# EAGLE design nano (EAGLE 7.2.0)
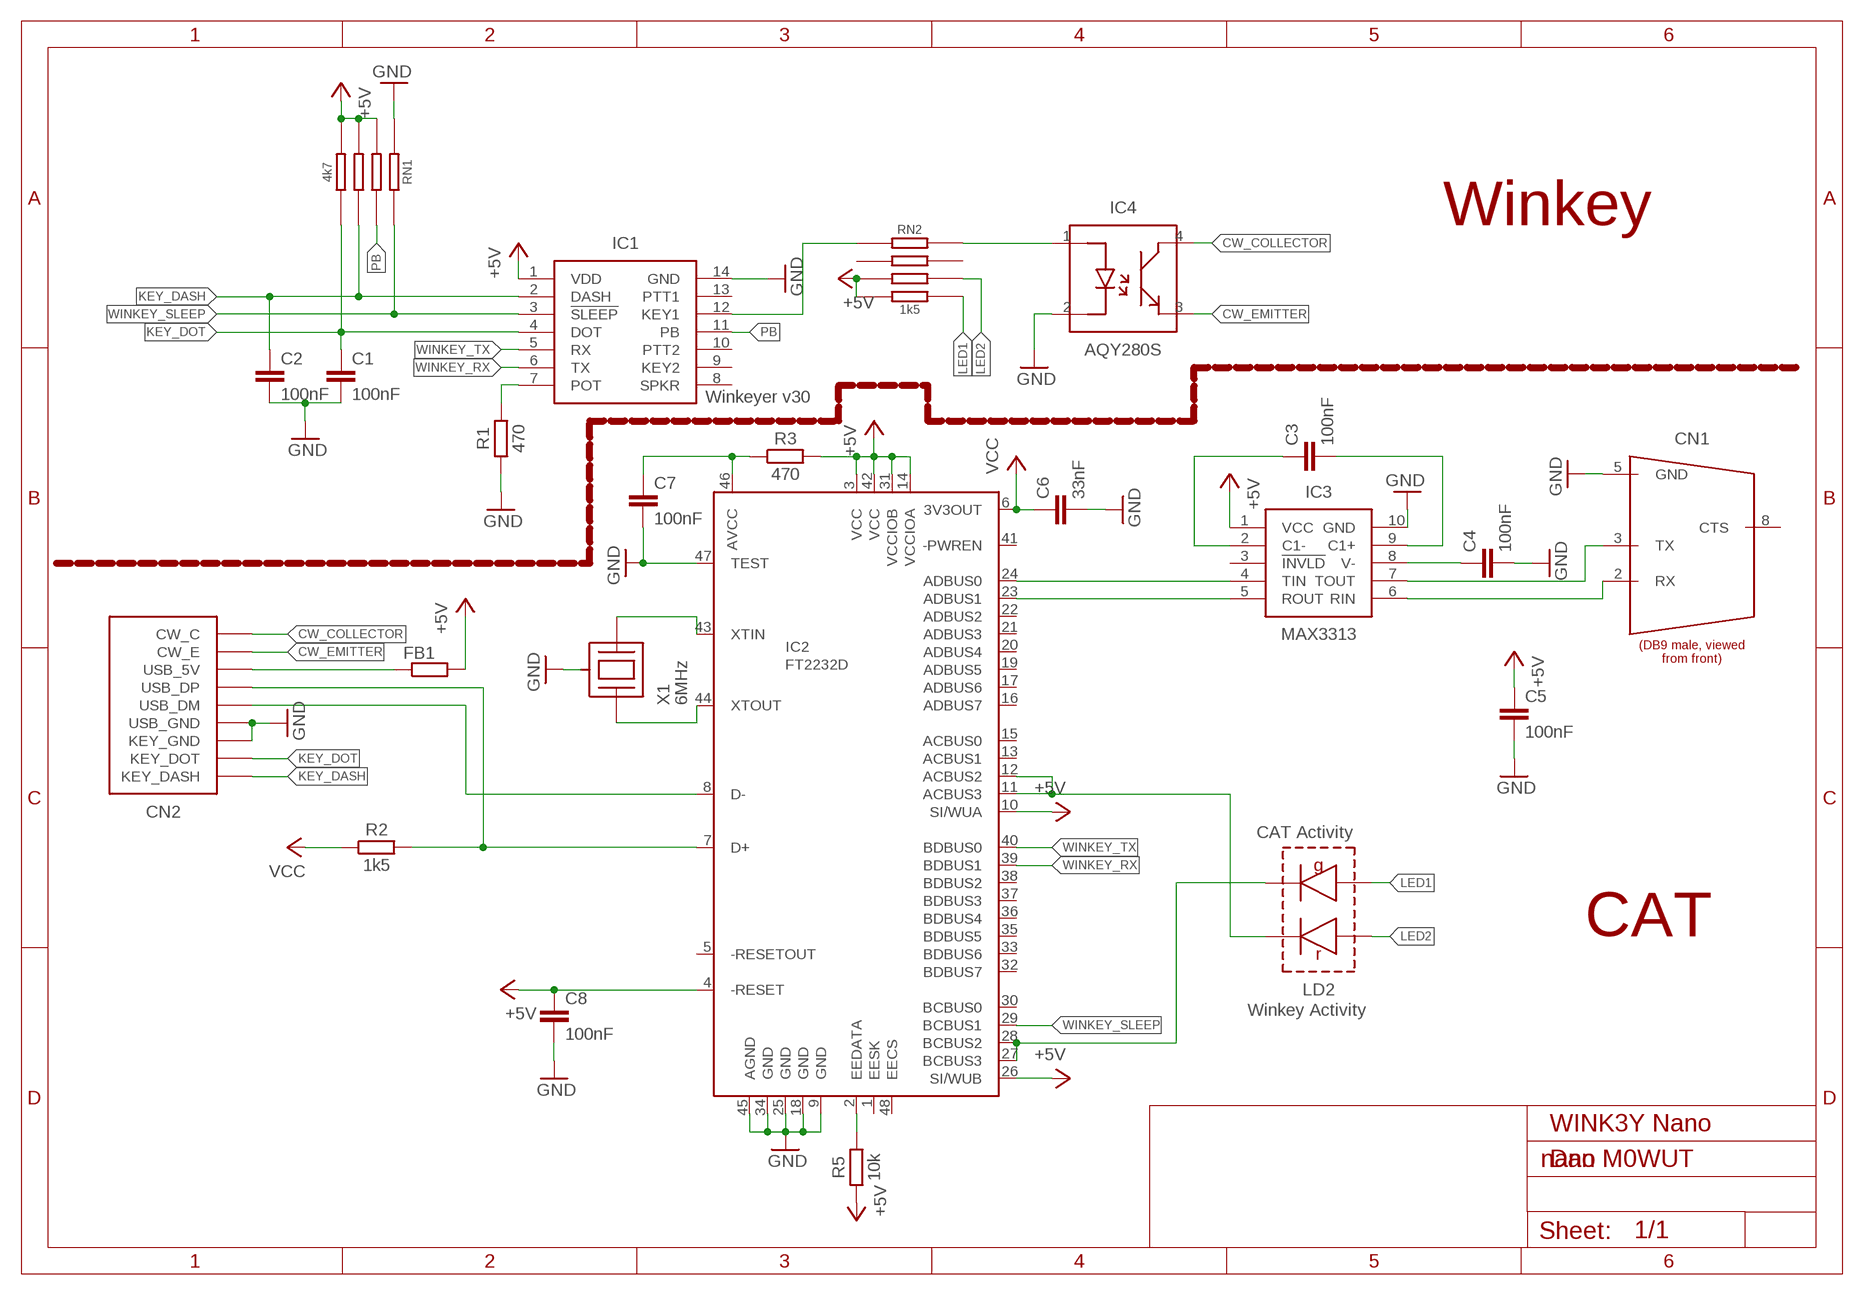
[diagram p0: schematic, sheet 1]

## Parts
C1  100nF  C-EUC0402  [C0402]
C2  100nF  C-EUC0402  [C0402]
C3  100nF  C-EUC0402  [C0402]
C4  100nF  C-EUC0402  [C0402]
C5  100nF  C-EUC0402  [C0402]
C6  33nF  C-EUC0402  [C0402]
C7  100nF  C-EUC0402  [C0402]
C8  100nF  C-EUC0402  [C0402]
CN1  CONN_DB9_MALE  [CONN_DB9]
CN2  CONN_WINK3Y  [CONN_2MMX9]
FB1  R-EU_R0805  [R0805]
IC1  WINKEYER  [SO14]
IC2  FT2232D  [QFP48-7X7]
IC3  IC_MAX3313  [IC_UMAX10]
IC4  IC_AQY280S  [IC_AQY280S]
LD2  LED_KINGBRIGHT_KPTB  [LED_KINGBRIGHT_KPTB]
R1  470  R-EU_R0402  [R0402]
R2  1k5  R-EU_R0402  [R0402]
R3  470  R-EU_R0402  [R0402]
R5  10k  R-EU_R0402  [R0402]
RN1  4k7  R_BOURNS_CAY16-J4  [R_BOURNS_CAY16-J4]
RN2  1k5  R_BOURNS_CAY16-J4  [R_BOURNS_CAY16-J4]
X1  6MHz  XTAL_MURATA_3-PIN-RES  [XTAL_MURATA_3-PIN-RES]

## Nets
+5V: C5.1 C8.1 FB1.2 IC1.1(VDD) IC2.3(VCC) IC2.4(-RESET) IC2.10(SI/WUA) IC2.14(VCCIOA) IC2.26(SI/WUB) IC2.31(VCCIOB) IC2.42(VCC) IC3.1(VCC) R3.2 R5.1 RN1.2 RN1.3 RN1.4 RN2.3 RN2.4
CAT_RX: IC2.23(ADBUS1) IC3.5(ROUT)
CAT_TX: IC2.24(ADBUS0) IC3.4(TIN)
CW_COLLECTOR: CN2.CW_COLLECTOR(CW_C) IC4.4(COLLECTOR)
CW_EMITTER: CN2.CW_EMITTER(CW_E) IC4.3(EMITTER)
GND: C1.2 C2.2 C4.2 C5.2 C6.2 C7.2 C8.2 CN1.5(GND) CN2.KEY_GND CN2.USB_GND IC1.14(GND) IC2.9(GND) IC2.18(GND) IC2.25(GND) IC2.34(GND) IC2.45(AGND) IC2.47(TEST) IC3.10(GND) IC4.2(CATHODE) R1.1 RN1.1 X1.GND(CAN)
KEY_DASH: C2.1 CN2.KEY_DASH IC1.2(DASH) RN1.3A
KEY_DOT: C1.1 CN2.KEY_DOT IC1.4(DOT) RN1.4A
LED1: LD2.3(G_ANODE) RN2.4A
LED2: LD2.1(R_ANODE) RN2.3A
N$1: C7.1 IC2.46(AVCC) R3.1
N$2: CN2.USB_5V FB1.1
N$3: IC2.43(XTIN) X1.2(XTAL2)
N$4: CN1.3(TX) IC3.7(TOUT)
N$5: CN1.2(RX) IC3.6(RIN)
N$6: C3.1 IC3.2(C1-)
N$7: C3.2 IC3.9(C1+)
N$8: C4.1 IC3.8(V-)
N$9: IC2.44(XTOUT) X1.1(XTAL1)
N$10: CN2.USB_DM IC2.8(D-)
N$11: IC1.12(KEY1) RN2.1
N$12: IC4.1(ANODE) RN2.1A
N$13: IC1.7(POT) R1.2
N$18: IC2.11(ACBUS3) IC2.12(ACBUS2) LD2.2(R_CATHODE)
N$19: IC2.2(EEDATA) R5.2
N$20: CN2.USB_DP IC2.7(D+) R2.2
PB: IC1.11(PB) RN1.2A
VCC: C6.1 IC2.6(3V3OUT) R2.1
WINKEY_ACT: IC2.27(BCBUS3) IC2.28(BCBUS2) LD2.4(G_CATHODE)
WINKEY_RX: IC1.6(TX) IC2.39(BDBUS1)
WINKEY_SLEEP: IC1.3(!SLEEP) IC2.29(BCBUS1) RN1.1A
WINKEY_TX: IC1.5(RX) IC2.40(BDBUS0)
Unconnected: CN1.8(CTS) IC1.8(SPKR) IC1.9(KEY2) IC1.10(PTT2) IC1.13(PTT1) IC2.1(EESK) IC2.5(-RESETOUT) IC2.13(ACBUS1) IC2.15(ACBUS0) IC2.16(ADBUS7) IC2.17(ADBUS6) IC2.19(ADBUS5) IC2.20(ADBUS4) IC2.21(ADBUS3) IC2.22(ADBUS2) IC2.30(BCBUS0) IC2.32(BDBUS7) IC2.33(BDBUS6) IC2.35(BDBUS5) IC2.36(BDBUS4) IC2.37(BDBUS3) IC2.38(BDBUS2) IC2.41(-PWREN) IC2.48(EECS) IC3.3(!INVLD) RN2.2 RN2.2A

## Notes on the sheet
- Winkey
- Winkeyer v30
- CAT Activity
- CAT
- Winkey Activity
- WINK3Y Nano
- Dan M0WUT

## Library data of the parts
C1-C8 = rcl:C-EU: CAPACITOR, European symbol
CN1 = m0wut:CONN_DB9_MALE
CN2 = m0wut:CONN_WINK3Y
FB1 = resistor:R-EU_: RESISTOR, European symbol
IC1 = m0wut:WINKEYER
IC2 = ftdichip-3:FT2232D: FT2232 DUAL USB UART/FIFO (4th Gen USB 2 full speed)
IC3 = m0wut:IC_MAX3313
IC4 = m0wut:IC_AQY280S
LD2 = m0wut:LED_KINGBRIGHT_KPTB
R1-R3 R5 = rcl:R-EU_: RESISTOR, European symbol
RN1 RN2 = m0wut:R_BOURNS_CAY16-J4
X1 = m0wut:XTAL_MURATA_3-PIN-RES: Murata CSTCR6M00G53Z-R0 Farnell: 2470365

## Board
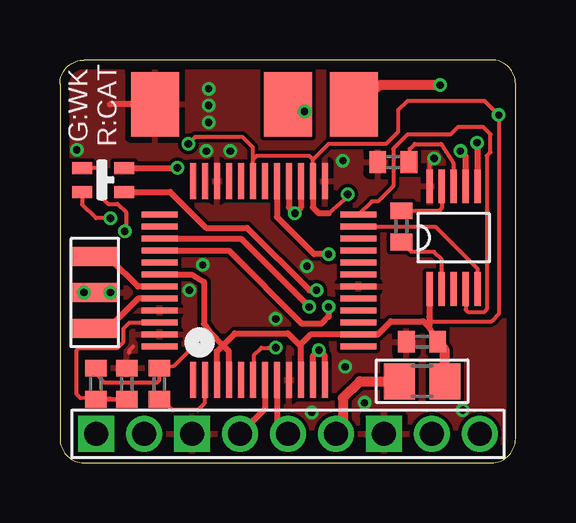
[diagram p1: board, top side]
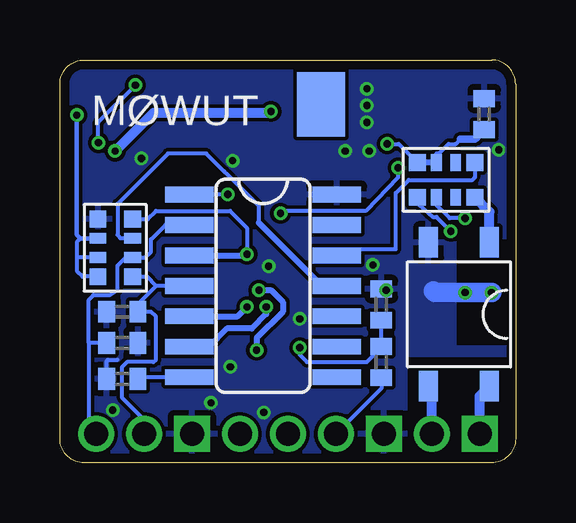
[diagram p2: board, bottom side, seen from below]

Size 19 x 16.8 mm. Coordinates in mm from the lower left corner, seen from the top.
Outline: 1,0 18,0 arc90 19,1 19,15.8 arc90 18,16.8 1,16.8 arc90 0,15.8 0,1 arc90 1,0
Copper layers (1*16): Top 0.035559375mm / dielectric 1.6mm / Bottom 0.035559375mm
Design rules "oshpark-2layer": minimum track width 6mil, minimum drill 10mil, track to track 6mil, track to pad 6mil, pad to pad 6mil, via to via 6mil, smd to smd 6mil, copper to edge 15mil, drill to drill 6mil, minimum pad ring 5mil, minimum via ring 5mil, stop-mask expansion 2.5mil, vias tented up to drill 0mil, thermal gap 10mil
tRestrict: area 0.5,4.9 to 2.4,9.3
bRestrict: area 0.3,0 to 4.5,4.4; area 0.5,4.9 to 2.5,9.3

### Footprints (pad centres in the part's own frame; a part is rotated, then mirrored left to right if it is on the bottom)
C0402 = smd 0.7 x 0.9: 1 -0.65,0; 2 0.65,0
CONN_DB9 = smd 2 x 2.7: 2 2.77,-1.85; 3 0,-1.85; 5 -5.54,-1.85 | smd 2 x 2.7 bottom: 8 -1.385,-1.85
CONN_2MMX9 = drill 1 square: CW_COLLECTOR -8,0; KEY_GND 4,0; USB_GND -4,0 | drill 1: CW_EMITTER -6,0; KEY_DASH 8,0; KEY_DOT 6,0; USB_5V 2,0; USB_DM 0,0; USB_DP -2,0
R0805 = smd 1.3 x 1.5: 1 -0.95,0; 2 0.95,0
SO14 = smd 0.66 x 2.032: 1 -3.81,-3.073; 2 -2.54,-3.073; 3 -1.27,-3.073; 4 0,-3.073; 5 1.27,-3.073; 6 2.54,-3.073; 7 3.81,-3.073; 8 3.81,3.073; 9 2.54,3.073; 10 1.27,3.073; 11 0,3.073; 12 -1.27,3.073; 13 -2.54,3.073; 14 -3.81,3.073
QFP48-7X7 = smd 0.25 x 1.5: 1 -2.75,-4.15; 2 -2.25,-4.15; 3 -1.75,-4.15; 4 -1.25,-4.15; 5 -0.75,-4.15; 6 -0.25,-4.15; 7 0.25,-4.15; 8 0.75,-4.15; 9 1.25,-4.15; 10 1.75,-4.15; 11 2.25,-4.15; 12 2.75,-4.15; 25 2.75,4.15; 26 2.25,4.15; 27 1.75,4.15; 28 1.25,4.15; 29 0.75,4.15; 30 0.25,4.15; 31 -0.25,4.15; 32 -0.75,4.15; 33 -1.25,4.15; 34 -1.75,4.15; 35 -2.25,4.15; 36 -2.75,4.15 | smd 1.5 x 0.25: 13 4.15,-2.75; 14 4.15,-2.25; 15 4.15,-1.75; 16 4.15,-1.25; 17 4.15,-0.75; 18 4.15,-0.25; 19 4.15,0.25; 20 4.15,0.75; 21 4.15,1.25; 22 4.15,1.75; 23 4.15,2.25; 24 4.15,2.75; 37 -4.15,2.75; 38 -4.15,2.25; 39 -4.15,1.75; 40 -4.15,1.25; 41 -4.15,0.75; 42 -4.15,0.25; 43 -4.15,-0.25; 44 -4.15,-0.75; 45 -4.15,-1.25; 46 -4.15,-1.75; 47 -4.15,-2.25; 48 -4.15,-2.75
IC_UMAX10 = smd 1.4 x 0.28: 1 -2.14,1; 2 -2.14,0.5; 3 -2.14,0; 4 -2.14,-0.5; 5 -2.14,-1; 6 2.14,-1; 7 2.14,-0.5; 8 2.14,0; 9 2.14,0.5; 10 2.14,1
IC_AQY280S = smd 0.8 x 1.27: 1 -1.27,-3; 2 1.27,-3; 3 1.27,3; 4 -1.27,3
LED_KINGBRIGHT_KPTB = smd 0.85 x 0.5: 1 0.875,0.5; 2 -0.875,0.5; 3 0.875,-0.5; 4 -0.875,-0.5
R0402 = smd 0.7 x 0.9: 1 -0.65,0; 2 0.65,0
R_BOURNS_CAY16-J4 = smd 0.7 x 0.7: 1 -1.2,-0.725; 1A -1.2,0.725; 4 1.2,-0.725; 4A 1.2,0.725 | smd 0.45 x 0.7: 2 -0.4,-0.725; 2A -0.4,0.725; 3 0.4,-0.725; 3A 0.4,0.725
XTAL_MURATA_3-PIN-RES = smd 0.8 x 1.9: 1 -1.5,0; 2 1.5,0; GND 0,0

### Placement (x,y rotation side)
C1  16.4,6.3 180 bottom
C2  16.4,5 0 bottom
C3  14.24,9.86 90 top
C4  13.9,12.54 180 top
C5  1.31,14.54 90 bottom
C6  5.6,6.6 90 bottom
C7  2.79,3.3 90 top
C8  15.1,5.05 180 top
CN1  9.5,16.8 0 top
CN2  9.5,1.2 0 top
FB1  15.1,3.4 0 top
IC1  10.53,7.38 270 bottom
IC2  8.3,7.6 0 top
IC3  16.42,9.39 90 top
IC4  2.36,6.19 180 bottom
LD2  1.8,11.8 180 top
R1  16.4,3.5 0 bottom
R2  5.6,4.2 270 bottom
R3  1.5,3.3 90 top
R5  4.15,3.3 270 top
RN1  16.69,8.96 270 bottom
RN2  2.9,11.8 180 bottom
X1  1.45,7.1 90 top

### Tracks (layer width: path | path; a pad name or v marks a point on that pad's centre or on a via)
+5V  (via drill 0.3)
  Top 0.16: IC2.26 10.55,12.65 | 10.55,12.65 10.4,12.8 8.2,12.8 8.05,12.65 | IC2.31 8.05,12.65 | 15.4,7.23 IC3.1 15.42,6.12 15.4,6.1 | 15.4,5.9 18,5.9 18.3,6.2 v18.3,14.5 17.7,15.1 14.5,15.1 14.1,14.7 14.1,13.8 13.6,13.3 11.2,13.3 10.55,12.65 | 8.05,12.65 8.05,13.15 7.6,13.6 5.65,13.6 v5.35,13.3 | 6.22,5.5 4.77,4.05 R5.1 4.15,3.45 4.05,3.35 1.85,3.35 1.5,3.7 R3.2 | v12,11.2 12,11.1 11.2,10.4
  Top 0.254: IC2.3 6.55,4.65 6.8,4.9 | IC2.4 7.05,4.65 6.8,4.9 | IC2.10 10.05,4.95 | 10.05,4.95 10.45,5.35 IC2.14 13.25,5.35 13.8,5.9 15.15,5.9 15.35,5.7 | 10.05,4.95 10,4.9 9.5,5.4 7.3,5.4 6.8,4.9 | IC2.42 5.5,7.85 6,7.55 6,5.8 6.22,5.5 6.25,5.45 6.8,4.9 | 11.2,10.4 10.8,10.4 10.55,10.65 IC2.26 | 15.4,7.23 15.4,6.1 15.4,5.9 15.4,5.7 15.35,5.7 | 15.35,5.7 C8.1
  Top 0.406: FB1.2 16.05,4.7 C8.1
  Bottom 0.16: 18.14,9.36 18.3,9.2 18.3,8.56 | 18.3,8.56 18.3,8 18.06,7.76 RN1.4 18.04,7.76 | RN2.3 3.3,12.9 3.2,12.9 2.8,13.3 2.5,13.3 2.3,13.5 | 18.14,9.36 18.3,9.52 v18.3,14.5 18.3,9.5 18.16,9.36 RN1.2 18.14,9.36 | RN1.3 18.3,8.56 | IC1.1 13.3,11.2 v12,11.2 | v5.35,13.3 4.88,13.3 RN2.4
  Bottom 0.254: RN2.3 RN2.4 3.98,12.53 | IC1.1 | 1.63,13.5 C5.1
  Bottom 0.305: 2.3,13.5 1.7,13.5 C5.1
CAT_RX
  Top 0.16: IC3.5 17.42,8.08 15.65,9.85 IC2.23
CAT_TX
  Top 0.16: IC3.4 16.92,6.38 17,6.3 17.7,6.3 17.8,6.4 17.8,12.8 17.95,12.95 17.95,13.7 17.65,14 16.6,14 16.3,13.7 14.5,13.7 13.9,13.1 13.9,11.55 13.25,10.9 13,10.9 IC2.24
CW_COLLECTOR
  Bottom 0.406: CN2.CW_COLLECTOR 1.5,2.78 IC4.4
CW_EMITTER
  Bottom 0.406: CN2.CW_EMITTER 3.5,3.06 IC4.3
GND  (via drill 0.3)
  Top 0.16: v1,7.1 2,7.11 X1.GND | 2.89,4.59 2.9,4.7 3.05,4.85 | IC3.10 15.42,12.52 v15.6,12.7
  Top 0.254: 2.08,14.95 CN1.5 4.35,14.95
  Bottom 0.16: R1.1 17.05,4.25 17,4.3 16.6,4.3 | v15.6,12.7 15.6,12.6
  Bottom 0.813: v1,7.1 v2.1,7.1 3.36,7.1 3.43,7.17
  other vias: 6.2,14.9 16.8,2.2 10.5,2.1 0.7,13.05 6.2,14.2 6.2,15.6 6.1,13 7.1,13 5.95,8.25 9,6 10.3,8.2 12.7,2.5 11.9,4 11.8,12.6 5.4,7.2
  pour Bottom: -1,-1 20,-1 20,17.8 -1,17.8
  pour Top: -2,-2 21,-2 21,18.8 -2,18.8
KEY_DASH
  Bottom 0.16: IC1.2 14.6,9.92 15.2,9.32 15.2,8.8 15.44,8.56 RN1.3A 16.27,8.56 16.6,8.22 16.6,7.2 16.9,7 17.6,7 17.8,6.8 17.8,5 | C2.1 17.8,5 | 17.8,5 17.8,1.5 CN2.KEY_DASH
KEY_DOT
  Bottom 0.16: IC1.4 14.98,7.38 | 14.98,7.38 15.36,7.76 RN1.4A | C1.1 15.8,6.56 14.98,7.38 | C1.1 15.8,6 | 15.6,6.09 C1.1 | C1.1 15.2,6.3 15,6.1 15,4.3 15.1,4.2 16.2,4.2 16.4,4 16.4,2.7 15.5,1.8 CN2.KEY_DOT
LED1  (via drill 0.3)
  Top 0.16: LD2.3 1.6,12.3 1.8,12.1 1.8,11 2,10.8 2.4,10.8 2.75,10.45 2.75,9.7 v2.7,9.65
  Bottom 0.16: RN2.4A 4.1,10.8 4.05,10.8 3.45,10.25 3.3,10.25 v2.7,9.65
LED2  (via drill 0.3)
  Top 0.16: v2.1,10.2 1.5,10.2 0.93,10.78 LD2.1
  Bottom 0.16: v2.1,10.2 2.75,10.2 3.3,10.75 3.3,10.8 RN2.3A
N$1
  Top 0.16: R3.1 C7.1 0.85,2.7 0.7,2.85 0.7,4.7 0.8,4.8 2.4,4.8 2.65,5.05 2.65,5.6 2.9,5.85 IC2.46
N$2
  Top 0.406: FB1.1 12.5,3.4 11.8,2.7 11.8,1.5 CN2.USB_5V
N$3
  Top 0.254: IC2.43 3.25,7.35 2.1,8.5 1.55,8.5 X1.2
N$4  (via drill 0.3)
  Top 0.254: IC3.7 16.92,12.78 v16.7,13
  Top 0.406: v10.2,14.65 9.8,15.4 | 9.8,15.4 9.9,15.5 | 9.8,15.4 CN1.3
  Bottom 0.406: v16.7,13 15.1,14.6 10.15,14.6 v10.2,14.65
N$5  (via drill 0.3)
  Top 0.254: IC3.6 17.42,13.18 v17.4,13.35
  Top 0.406: v15.85,15.75 13.37,15.75 CN1.2
  Bottom 0.16: v17.4,13.35 17.4,14.2 v15.85,15.75
N$6
  Top 0.16: IC3.2 15.92,8.48 15.6,8.8 14.65,8.8 C3.1
N$7
  Top 0.16: C3.2 14.15,10.5 15.8,10.5 15.92,10.62 IC3.9
N$8
  Top 0.16: C4.1 14.59,12.5 14.59,13.09 14.8,13.3 15.9,13.3 16.42,12.48 IC3.8
N$9
  Top 0.16: 2.2,5.8 1.75,5.9 X1.1
  Top 0.254: IC2.44 3.25,6.85 2.2,5.8
N$10
  Top 0.254: IC2.8 9.05,1.65 CN2.USB_DM
N$11
  Bottom 0.16: RN2.1 1.7,11.9 1.8,11.8 4.45,11.8 5,11.25 5,8.9 7.21,8.9 IC1.12
N$12
  Bottom 0.406: IC4.1 1.09,10.46 RN2.1A
N$13
  Bottom 0.16: IC1.7 15.81,3.57 R1.2
N$18  (via drill 0.3)
  Top 0.254: LD2.2 4.6,11.3 6.1,9.8 7.8,9.8 10.4,7.2 v10.7,7.2 | IC2.11 10.55,4.45 v10.8,4.7 11.05,4.45 IC2.12
  Bottom 0.254: v10.7,7.2 10.2,7.2 9.7,6.7 9.7,6.3 10.8,5.2 v10.8,4.7
N$19
  Top 0.16: IC2.2 6.05,2.5 5.75,2.2 4.7,2.2 R5.2
N$20
  Top 0.254: IC2.7 8.55,2.25 CN2.USB_DP
  Bottom 0.16: R2.2 5.6,3.1 CN2.USB_DP
PB
  Bottom 0.16: IC1.11 8.08,7.38 | RN1.2A 16.46,9.36 16.6,9.5 16.6,10.8 14.5,12.9 12.9,12.9 12.15,12.15 12,12 10.7,10.7 10.7,10
  Bottom 0.254: 8.08,7.38 10.7,10
VCC  (via drill 0.3)
  Top 0.16: IC2.6 8.1,3.4 8.1,4.5 8.4,4.8 v9,4.8
  Bottom 0.16: C6.1 R2.1 5.6,4.8 6.2,4.2 8.7,4.2 9,4.5 v9,4.8
WINKEY_ACT  (via drill 0.3)
  Top 0.254: IC2.28 9.55,10.65 v9.8,10.4 10.05,10.65 IC2.27 | LD2.4 v4.9,12.3
  Bottom 0.16: v4.9,12.3 4.9,11.9 6.25,10.5 9.7,10.5 v9.8,10.4
WINKEY_RX  (via drill 0.3)
  Top 0.254: IC2.39 7.55,9.35 v10.4,6.5
  Bottom 0.254: v10.4,6.5 10.4,6.2 11,5.6 12.04,5.6 12.8,4.84 IC1.6
WINKEY_SLEEP  (via drill 0.3)
  Top 0.254: IC2.29 9.05,10.25 10.6,8.7 v11.2,8.7
  Bottom 0.16: 13.69,8.56 IC1.3 | RN1.1A 15.34,10.16 15,10.5 11.9,10.5 11.2,9.8 v11.2,8.7
  Bottom 0.254: IC1.3 11.25,8.65 v11.2,8.7
WINKEY_TX  (via drill 0.3)
  Top 0.254: v11.2,6.5 11.2,6.1 10.9,5.8 10.1,5.8 7.05,8.85 IC2.40
  Bottom 0.254: IC1.5 11.59,6.11 v11.2,6.5

### Text on the board
tPlace: G:WK / R:CAT
bPlace: MØWUT